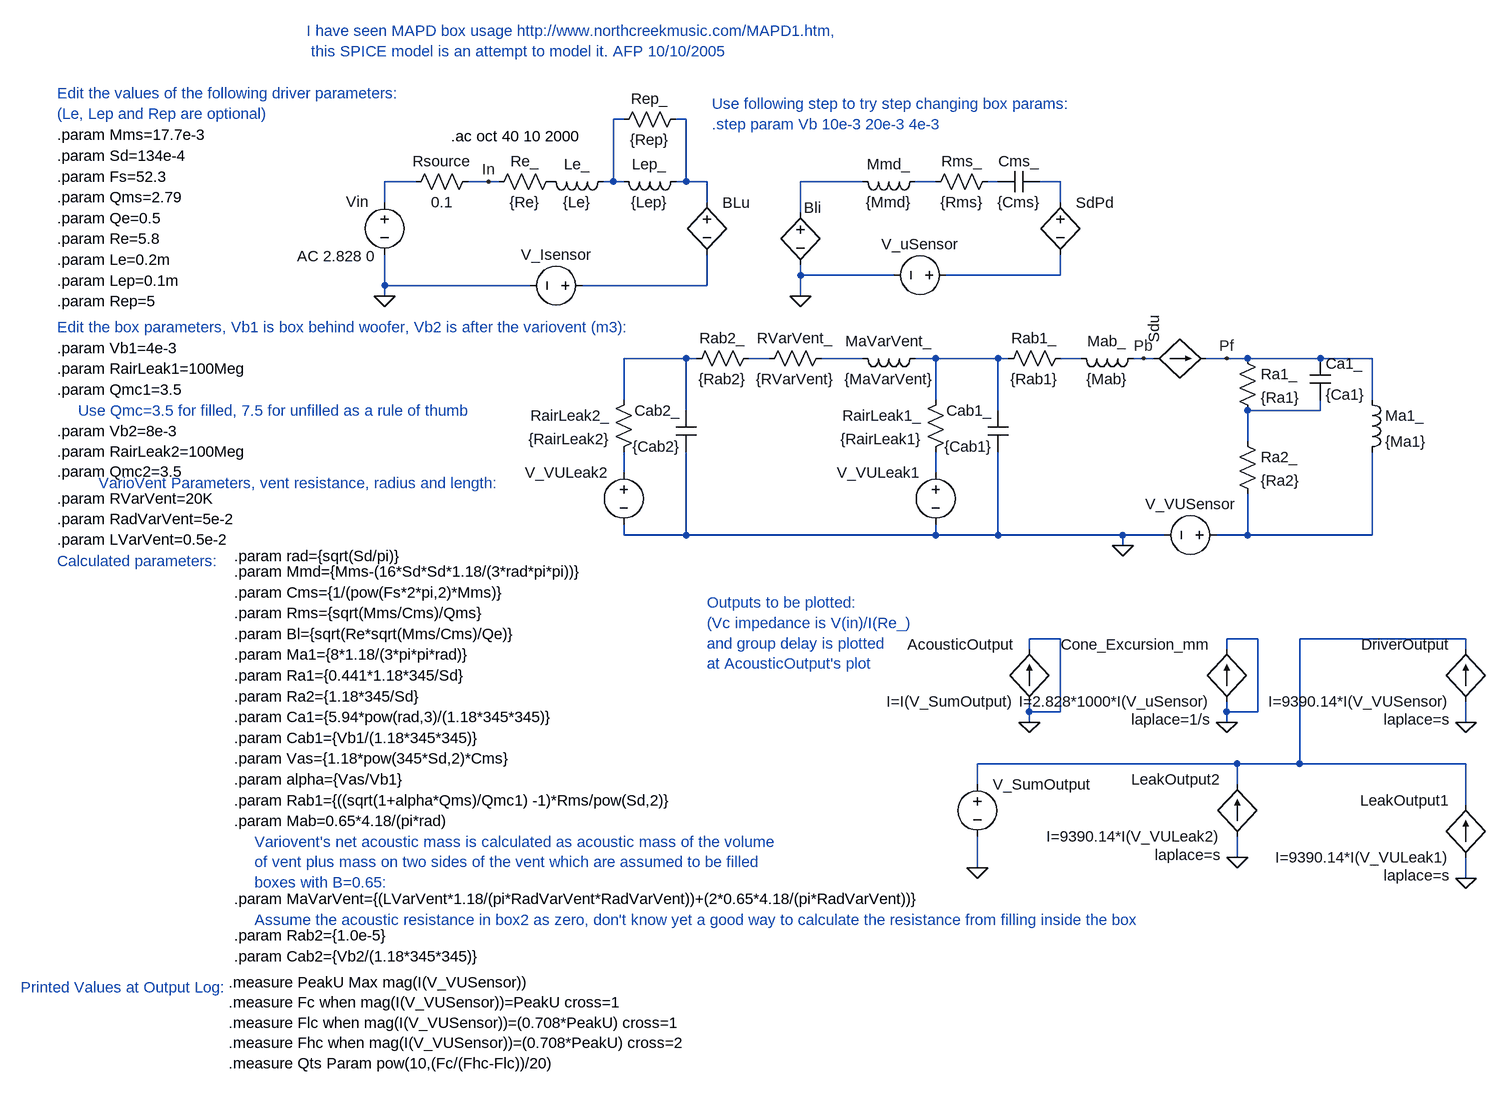
[diagram p0: schematic MAPDBox.asc]
MAPDBox.asc, the LTspice schematic file:
Version 4
SHEET 1 880 776
WIRE -1712 -640 -1712 -672
WIRE -1712 -512 -1712 -560
WIRE -1712 -496 -1712 -512
WIRE -1664 -672 -1712 -672
WIRE -1552 -672 -1584 -672
WIRE -1536 -672 -1552 -672
WIRE -1488 -512 -1712 -512
WIRE -1360 -672 -1376 -672
WIRE -1360 -672 -1360 -768
WIRE -1344 -768 -1360 -768
WIRE -1344 -672 -1360 -672
WIRE -1344 -336 -1344 -400
WIRE -1344 -224 -1344 -256
WIRE -1344 -128 -1344 -144
WIRE -1248 -768 -1264 -768
WIRE -1248 -672 -1264 -672
WIRE -1248 -672 -1248 -768
WIRE -1248 -400 -1344 -400
WIRE -1248 -320 -1248 -400
WIRE -1248 -128 -1344 -128
WIRE -1248 -128 -1248 -256
WIRE -1232 -400 -1248 -400
WIRE -1216 -672 -1248 -672
WIRE -1216 -640 -1216 -672
WIRE -1216 -512 -1408 -512
WIRE -1216 -512 -1216 -560
WIRE -1120 -400 -1152 -400
WIRE -1072 -624 -1072 -672
WIRE -1072 -528 -1072 -544
WIRE -1072 -496 -1072 -528
WIRE -976 -672 -1072 -672
WIRE -976 -400 -1040 -400
WIRE -928 -528 -1072 -528
WIRE -864 -672 -896 -672
WIRE -864 -400 -896 -400
WIRE -864 -336 -864 -400
WIRE -864 -224 -864 -256
WIRE -864 -128 -1248 -128
WIRE -864 -128 -864 -144
WIRE -800 256 -800 224
WIRE -800 384 -800 336
WIRE -768 -672 -784 -672
WIRE -768 -400 -864 -400
WIRE -768 -320 -768 -400
WIRE -768 -128 -864 -128
WIRE -768 -128 -768 -256
WIRE -752 -400 -768 -400
WIRE -720 48 -720 32
WIRE -720 144 -720 128
WIRE -720 160 -720 144
WIRE -672 -672 -704 -672
WIRE -672 -640 -672 -672
WIRE -672 -528 -848 -528
WIRE -672 -528 -672 -560
WIRE -672 32 -720 32
WIRE -672 144 -720 144
WIRE -672 144 -672 32
WIRE -640 -400 -672 -400
WIRE -576 -128 -768 -128
WIRE -576 -112 -576 -128
WIRE -544 -400 -560 -400
WIRE -528 -400 -544 -400
WIRE -512 -128 -576 -128
WIRE -416 -400 -448 -400
WIRE -416 48 -416 32
WIRE -416 144 -416 128
WIRE -416 160 -416 144
WIRE -400 224 -800 224
WIRE -400 256 -400 224
WIRE -400 368 -400 336
WIRE -384 -400 -416 -400
WIRE -384 -272 -384 -320
WIRE -384 -128 -432 -128
WIRE -384 -128 -384 -192
WIRE -368 32 -416 32
WIRE -368 144 -416 144
WIRE -368 144 -368 32
WIRE -304 224 -400 224
WIRE -304 224 -304 32
WIRE -272 -400 -384 -400
WIRE -272 -320 -384 -320
WIRE -272 -320 -272 -336
WIRE -192 -400 -272 -400
WIRE -192 -336 -192 -400
WIRE -192 -128 -384 -128
WIRE -192 -128 -192 -256
WIRE -48 32 -304 32
WIRE -48 48 -48 32
WIRE -48 160 -48 128
WIRE -48 224 -304 224
WIRE -48 288 -48 224
WIRE -48 400 -48 368
FLAG -1712 -496 0
FLAG -1072 -496 0
FLAG -576 -112 0
FLAG -416 -400 Pf
FLAG -1552 -672 In
FLAG -720 160 0
FLAG -416 160 0
FLAG -544 -400 Pb
FLAG -48 160 0
FLAG -48 400 0
FLAG -400 368 0
FLAG -800 384 0
SYMBOL voltage -1712 -656 R0
WINDOW 3 24 44 Left 0
WINDOW 123 -135 99 Left 0
WINDOW 39 0 0 Left 0
WINDOW 0 -59 15 Left 0
SYMATTR Value ""
SYMATTR Value2 AC 2.828 0
SYMATTR InstName Vin
SYMBOL res -1440 -688 R90
WINDOW 0 0 56 VBottom 0
WINDOW 3 32 56 VTop 0
SYMATTR InstName Re_
SYMATTR Value {Re}
SYMBOL ind -1360 -688 R90
WINDOW 0 5 56 VBottom 0
WINDOW 3 32 56 VTop 0
SYMATTR InstName Le_
SYMATTR Value {Le}
SYMBOL voltage -1392 -512 R90
WINDOW 0 -32 56 VBottom 0
WINDOW 3 32 56 VTop 0
WINDOW 39 0 0 Left 0
SYMATTR InstName V_Isensor
SYMATTR Value ""
SYMATTR Value2 AC 0
SYMBOL h -1216 -656 R0
WINDOW 3 24 44 Invisible 0
SYMATTR Value V_uSensor
SYMATTR InstName BLu
SYMATTR Value2 {Bl}
SYMBOL h -1072 -640 R0
WINDOW 0 5 8 Left 0
WINDOW 3 24 104 Invisible 0
SYMATTR InstName Bli
SYMATTR Value V_ISensor
SYMATTR Value2 {BL}
SYMBOL ind -880 -688 R90
WINDOW 0 5 56 VBottom 0
WINDOW 3 32 56 VTop 0
SYMATTR InstName Mmd_
SYMATTR Value {Mmd}
SYMBOL res -768 -688 R90
WINDOW 0 0 56 VBottom 0
WINDOW 3 32 56 VTop 0
SYMATTR InstName Rms_
SYMATTR Value {Rms}
SYMBOL cap -704 -688 R90
WINDOW 0 0 32 VBottom 0
WINDOW 3 32 32 VTop 0
SYMATTR InstName Cms_
SYMATTR Value {Cms}
SYMBOL h -672 -656 R0
WINDOW 3 24 104 Invisible 0
SYMATTR Value Pf
SYMATTR InstName SdPd
SYMATTR Prefix E
SYMATTR Value2 Pb
SYMATTR SpiceLine {Sd}
SYMBOL voltage -832 -528 R90
WINDOW 0 -32 56 VBottom 0
WINDOW 3 32 56 VTop 0
WINDOW 39 0 0 Left 0
SYMATTR InstName V_uSensor
SYMATTR Value ""
SYMATTR Value2 AC 0
SYMBOL f -528 -400 R270
WINDOW 3 24 88 Invisible 0
SYMATTR Value V_uSensor
SYMATTR InstName Sdu
SYMATTR Value2 {Sd}
SYMBOL res -400 -416 R0
SYMATTR InstName Ra1_
SYMATTR Value {Ra1}
SYMBOL res -400 -288 R0
SYMATTR InstName Ra2_
SYMATTR Value {Ra2}
SYMBOL cap -288 -400 R0
SYMATTR InstName Ca1_
SYMATTR Value {Ca1}
SYMBOL ind -208 -352 R0
SYMATTR InstName Ma1_
SYMATTR Value {Ma1}
SYMBOL ind -1248 -688 R90
WINDOW 0 5 56 VBottom 0
WINDOW 3 32 56 VTop 0
SYMATTR InstName Lep_
SYMATTR Value {Lep}
SYMBOL res -1360 -752 R270
WINDOW 0 32 56 VTop 0
WINDOW 3 0 56 VBottom 0
SYMATTR InstName Rep_
SYMATTR Value {Rep}
SYMBOL res -1680 -656 R270
WINDOW 0 32 56 VTop 0
WINDOW 3 0 56 VBottom 0
SYMATTR InstName Rsource
SYMATTR Value 0.1
SYMBOL voltage -416 -128 R90
WINDOW 0 -32 56 VBottom 0
WINDOW 3 32 56 VTop 0
WINDOW 39 0 0 Left 0
SYMATTR InstName V_VUSensor
SYMATTR Value ""
SYMATTR Value2 AC 0
SYMBOL bi -720 128 R180
WINDOW 0 24 88 Left 0
WINDOW 3 24 0 Left 0
SYMATTR InstName AcousticOutput
SYMATTR Value I=I(V_SumOutput)
SYMBOL bi -416 128 R180
WINDOW 0 24 88 Left 0
WINDOW 3 24 0 Left 0
WINDOW 39 24 -28 Left 0
SYMATTR InstName Cone_Excursion_mm
SYMATTR Value I=2.828*1000*I(V_uSensor)
SYMATTR SpiceLine laplace=1/s
SYMBOL ind -544 -416 R90
WINDOW 0 5 56 VBottom 0
WINDOW 3 32 56 VTop 0
SYMATTR InstName Mab_
SYMATTR Value {Mab}
SYMBOL res -656 -416 R90
WINDOW 0 0 56 VBottom 0
WINDOW 3 32 56 VTop 0
SYMATTR InstName Rab1_
SYMATTR Value {Rab1}
SYMBOL cap -752 -256 R180
WINDOW 0 24 64 Left 0
WINDOW 3 24 8 Left 0
SYMATTR InstName Cab1_
SYMATTR Value {Cab1}
SYMBOL res -848 -352 M0
SYMATTR InstName RairLeak1_
SYMATTR Value {RairLeak1}
SYMBOL ind -880 -416 R90
WINDOW 0 5 56 VBottom 0
WINDOW 3 32 56 VTop 0
SYMATTR InstName MaVarVent_
SYMATTR Value {MaVarVent}
SYMBOL res -1024 -416 R90
WINDOW 0 0 56 VBottom 0
WINDOW 3 32 56 VTop 0
SYMATTR InstName RVarVent_
SYMATTR Value {RVarVent}
SYMBOL cap -1232 -256 R180
WINDOW 0 24 64 Left 0
WINDOW 3 24 8 Left 0
SYMATTR InstName Cab2_
SYMATTR Value {Cab2}
SYMBOL res -1328 -352 M0
SYMATTR InstName RairLeak2_
SYMATTR Value {RairLeak2}
SYMBOL res -1136 -416 R90
WINDOW 0 0 56 VBottom 0
WINDOW 3 32 56 VTop 0
SYMATTR InstName Rab2_
SYMATTR Value {Rab2}
SYMBOL voltage -864 -240 M0
WINDOW 39 0 0 Left 0
SYMATTR InstName V_VULeak1
SYMATTR Value ""
SYMATTR Value2 AC 0
SYMBOL voltage -1344 -240 M0
WINDOW 39 0 0 Left 0
SYMATTR InstName V_VULeak2
SYMATTR Value ""
SYMATTR Value2 AC 0
SYMBOL bi -48 128 R180
WINDOW 0 24 88 Left 0
WINDOW 3 24 0 Left 0
WINDOW 39 24 -28 Left 0
SYMATTR InstName DriverOutput
SYMATTR Value I=9390.14*I(V_VUSensor)
SYMATTR SpiceLine laplace=s
SYMBOL bi -48 368 R180
WINDOW 0 24 88 Left 0
WINDOW 3 24 0 Left 0
WINDOW 39 24 -28 Left 0
SYMATTR InstName LeakOutput1
SYMATTR Value I=9390.14*I(V_VULeak1)
SYMATTR SpiceLine laplace=s
SYMBOL bi -400 336 R180
WINDOW 0 24 88 Left 0
WINDOW 3 24 0 Left 0
WINDOW 39 24 -28 Left 0
SYMATTR InstName LeakOutput2
SYMATTR Value I=9390.14*I(V_VULeak2)
SYMATTR SpiceLine laplace=s
SYMBOL voltage -800 240 R0
WINDOW 39 0 0 Left 0
SYMATTR InstName V_SumOutput
SYMATTR Value ""
SYMATTR Value2 AC 0
TEXT -1610 -742 Left 0 !.ac oct 40 10 2000
TEXT -1944 24 Left 0 !.param Bl={sqrt(Re*sqrt(Mms/Cms)/Qe)}
TEXT -2216 -744 Left 0 !.param Mms=17.7e-3
TEXT -1944 -72 Left 0 !.param Mmd={Mms-(16*Sd*Sd*1.18/(3*rad*pi*pi))}
TEXT -2216 -712 Left 0 !.param Sd=134e-4
TEXT -1944 -96 Left 0 !.param rad={sqrt(Sd/pi)}
TEXT -2216 -680 Left 0 !.param Fs=52.3
TEXT -1944 -8 Left 0 !.param Rms={sqrt(Mms/Cms)/Qms}
TEXT -1944 -40 Left 0 !.param Cms={1/(pow(Fs*2*pi,2)*Mms)}
TEXT -2216 -648 Left 0 !.param Qms=2.79
TEXT -2216 -616 Left 0 !.param Qe=0.5
TEXT -2216 -584 Left 0 !.param Re=5.8
TEXT -2216 -552 Left 0 !.param Le=0.2m
TEXT -2216 -520 Left 0 !.param Lep=0.1m
TEXT -2216 -488 Left 0 !.param Rep=5
TEXT -1944 56 Left 0 !.param Ma1={8*1.18/(3*pi*pi*rad)}
TEXT -1944 88 Left 0 !.param Ra1={0.441*1.18*345/Sd}
TEXT -1944 120 Left 0 !.param Ra2={1.18*345/Sd}
TEXT -1944 152 Left 0 !.param Ca1={5.94*pow(rad,3)/(1.18*345*345)}
TEXT -2216 -88 Left 0 ;Calculated parameters:
TEXT -2216 -808 Left 0 ;Edit the values of the following driver parameters:\n(Le, Lep and Rep are optional)
TEXT -1216 -24 Left 0 ;Outputs to be plotted:\n(Vc impedance is V(in)/I(Re_)\nand group delay is plotted\nat AcousticOutput's plot
TEXT -2216 -448 Left 0 ;Edit the box parameters, Vb1 is box behind woofer, Vb2 is after the variovent (m3):
TEXT -2216 -416 Left 0 !.param Vb1=4e-3
TEXT -1944 184 Left 0 !.param Cab1={Vb1/(1.18*345*345)}
TEXT -2216 -384 Left 0 !.param RairLeak1=100Meg
TEXT -2216 -352 Left 0 !.param Qmc1=3.5
TEXT -2184 -320 Left 0 ;Use Qmc=3.5 for filled, 7.5 for unfilled as a rule of thumb
TEXT -1944 216 Left 0 !.param Vas={1.18*pow(345*Sd,2)*Cms}
TEXT -1944 432 Left 0 !.param MaVarVent={(LVarVent*1.18/(pi*RadVarVent*RadVarVent))+(2*0.65*4.18/(pi*RadVarVent))}
TEXT -1944 248 Left 0 !.param alpha={Vas/Vb1}
TEXT -1944 280 Left 0 !.param Rab1={((sqrt(1+alpha*Qms)/Qmc1) -1)*Rms/pow(Sd,2)}
TEXT -1944 312 Left 0 !.param Mab=0.65*4.18/(pi*rad)
TEXT -1208 -792 Left 0 ;Use following step to try step changing box params:\n.step param Vb 10e-3 20e-3 4e-3
TEXT -1952 560 Left 0 !.measure PeakU Max mag(I(V_VUSensor))\n.measure Fc when mag(I(V_VUSensor))=PeakU cross=1\n.measure Flc when mag(I(V_VUSensor))=(0.708*PeakU) cross=1\n.measure Fhc when mag(I(V_VUSensor))=(0.708*PeakU) cross=2\n.measure Qts Param pow(10,(Fc/(Fhc-Flc))/20)
TEXT -2272 568 Left 0 ;Printed Values at Output Log:
TEXT -1832 -904 Left 0 ;I have seen MAPD box usage http://www.northcreekmusic.com/MAPD1.htm,\n this SPICE model is an attempt to model it. AFP 10/10/2005
TEXT -2216 -288 Left 0 !.param Vb2=8e-3\n.param RairLeak2=100Meg\n.param Qmc2=3.5
TEXT -2216 -184 Left 0 !.param RVarVent=20K\n.param RadVarVent=5e-2\n.param LVarVent=0.5e-2
TEXT -2152 -208 Left 0 ;VarioVent Parameters, vent resistance, radius and length:
TEXT -1944 488 Left 0 !.param Rab2={1.0e-5}
TEXT -1912 464 Left 0 ;Assume the acoustic resistance in box2 as zero, don't know yet a good way to calculate the resistance from filling inside the box
TEXT -1944 520 Left 0 !.param Cab2={Vb2/(1.18*345*345)}
TEXT -1912 344 Left 0 ;Variovent's net acoustic mass is calculated as acoustic mass of the volume \nof vent plus mass on two sides of the vent which are assumed to be filled \nboxes with B=0.65:

The netlist it stands for:
* MAPDBox.asc
Vin N001 0 AC 2.828 0
Re_ P001 In {Re}
Le_ N002 P001 {Le}
V_Isensor N006 0 AC 0
H§BLu N005 N006 V_uSensor {Bl}
H§Bli N008 0 V_ISensor {BL}
L§Mmd_ N010 N008 {Mmd}
Rms_ N014 N010 {Rms}
Cms_ N015 N014 {Cms}
E§SdPd N015 N016 Pf Pb {Sd}
V_uSensor N016 0 AC 0
F§Sdu Pb Pf V_uSensor {Sd}
Ra1_ Pf N018 {Ra1}
Ra2_ N018 N019 {Ra2}
Ca1_ Pf N018 {Ca1}
L§Ma1_ Pf N019 {Ma1}
Lep_ N005 N002 {Lep}
Rep_ N002 N005 {Rep}
Rsource N001 In 0.1
V_VUSensor N019 0 AC 0
B§AcousticOutput 0 0 I=I(V_SumOutput)
B§Cone_Excursion_mm 0 0 I=2.828*1000*I(V_uSensor) laplace=1/s
L§Mab_ Pb N017 {Mab}
Rab1_ N017 N011 {Rab1}
Cab1_ 0 N011 {Cab1}
RairLeak1_ N011 N012 {RairLeak1}
L§MaVarVent_ N011 N009 {MaVarVent}
RVarVent_ N009 N007 {RVarVent}
Cab2_ 0 N003 {Cab2}
RairLeak2_ N003 N004 {RairLeak2}
Rab2_ N007 N003 {Rab2}
V_VULeak1 N012 0 AC 0
V_VULeak2 N004 0 AC 0
B§DriverOutput 0 N013 I=9390.14*I(V_VUSensor) laplace=s
B§LeakOutput1 0 N013 I=9390.14*I(V_VULeak1) laplace=s
B§LeakOutput2 0 N013 I=9390.14*I(V_VULeak2) laplace=s
V_SumOutput N013 0 AC 0
.ac oct 40 10 2000
.param Bl={sqrt(Re*sqrt(Mms/Cms)/Qe)}
.param Mms=17.7e-3
.param Mmd={Mms-(16*Sd*Sd*1.18/(3*rad*pi*pi))}
.param Sd=134e-4
.param rad={sqrt(Sd/pi)}
.param Fs=52.3
.param Rms={sqrt(Mms/Cms)/Qms}
.param Cms={1/(pow(Fs*2*pi,2)*Mms)}
.param Qms=2.79
.param Qe=0.5
.param Re=5.8
.param Le=0.2m
.param Lep=0.1m
.param Rep=5
.param Ma1={8*1.18/(3*pi*pi*rad)}
.param Ra1={0.441*1.18*345/Sd}
.param Ra2={1.18*345/Sd}
.param Ca1={5.94*pow(rad,3)/(1.18*345*345)}
* Calculated parameters:
* Edit the values of the following driver parameters:
* (Le, Lep and Rep are optional)
* Outputs to be plotted:
* (Vc impedance is V(in)/I(Re_)
* and group delay is plotted
* at AcousticOutput's plot
* Edit the box parameters, Vb1 is box behind woofer, Vb2 is after the variovent (m3):
.param Vb1=4e-3
.param Cab1={Vb1/(1.18*345*345)}
.param RairLeak1=100Meg
.param Qmc1=3.5
* Use Qmc=3.5 for filled, 7.5 for unfilled as a rule of thumb
.param Vas={1.18*pow(345*Sd,2)*Cms}
.param MaVarVent={(LVarVent*1.18/(pi*RadVarVent*RadVarVent))+(2*0.65*4.18/(pi*RadVarVent))}
.param alpha={Vas/Vb1}
.param Rab1={((sqrt(1+alpha*Qms)/Qmc1) -1)*Rms/pow(Sd,2)}
.param Mab=0.65*4.18/(pi*rad)
* Use following step to try step changing box params:
* .step param Vb 10e-3 20e-3 4e-3
.measure PeakU Max mag(I(V_VUSensor))
.measure Fc when mag(I(V_VUSensor))=PeakU cross=1
.measure Flc when mag(I(V_VUSensor))=(0.708*PeakU) cross=1
.measure Fhc when mag(I(V_VUSensor))=(0.708*PeakU) cross=2
.measure Qts Param pow(10,(Fc/(Fhc-Flc))/20)
* Printed Values at Output Log:
* I have seen MAPD box usage http://www.northcreekmusic.com/MAPD1.htm,
*  this SPICE model is an attempt to model it. AFP 10/10/2005
.param Vb2=8e-3
.param RairLeak2=100Meg
.param Qmc2=3.5
.param RVarVent=20K
.param RadVarVent=5e-2
.param LVarVent=0.5e-2
* VarioVent Parameters, vent resistance, radius and length:
.param Rab2={1.0e-5}
* Assume the acoustic resistance in box2 as zero, don't know yet a good way to calculate the resistance from filling inside the box
.param Cab2={Vb2/(1.18*345*345)}
* Variovent's net acoustic mass is calculated as acoustic mass of the volume
* of vent plus mass on two sides of the vent which are assumed to be filled
* boxes with B=0.65:
.backanno
.end